# EasyEDA Pro project bandolibre.eprj, schematic ProgramConnector
Board Name: ProgramConnector; Create Date: 2026-05-26; Page Name: P1; Project Name: bandoneo; Schematic Name: ProgramConnector; Update Date: 2026-05-26; Company: EasyEDA.com; Page Size: A4; Version: V1.0
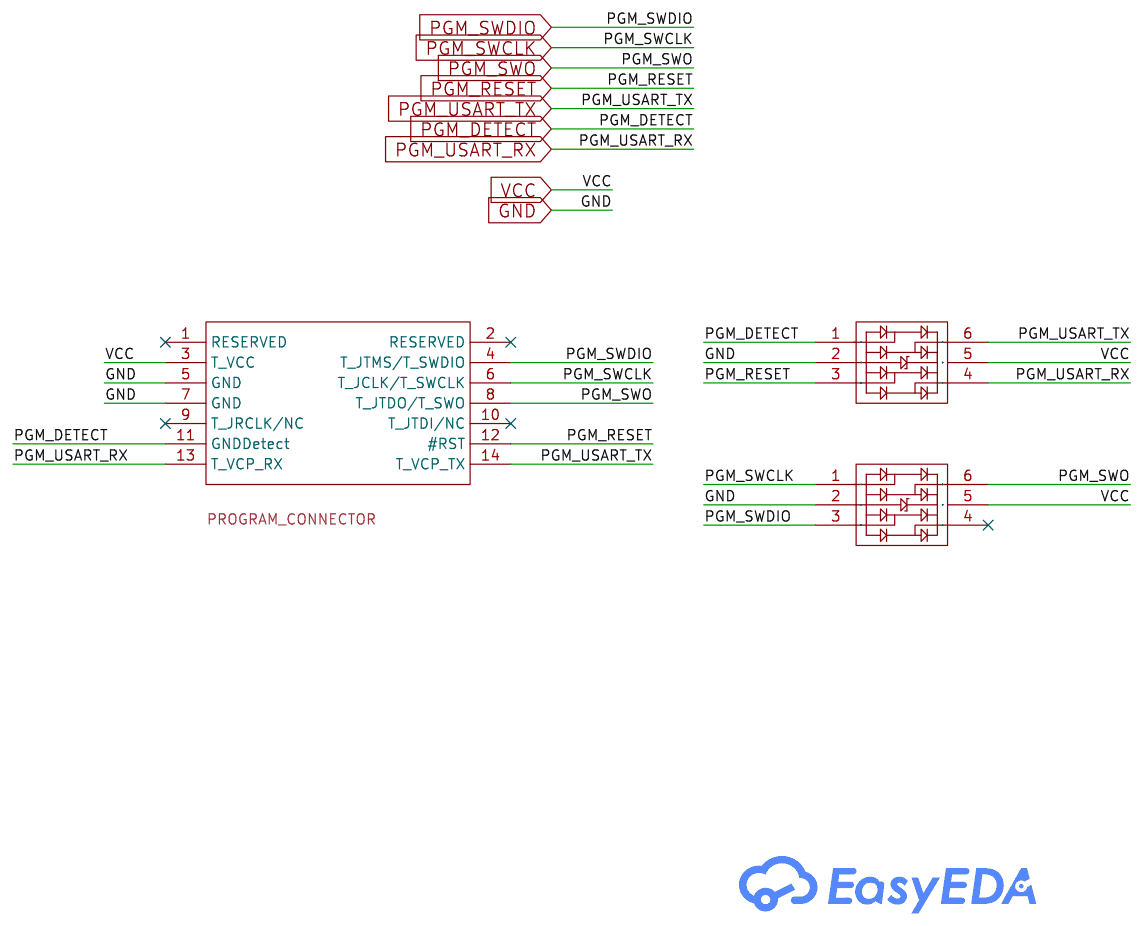
[diagram p7: schematic sheet]

## Parts
CN3  -  [TC2070_Landing_Pattern]  (no BOM)
TV5  SRV05-4-P-T7  [SOT-23-6_L2.9-W1.6-P0.95-LS2.8-BR]
TV6  SRV05-4-P-T7  [SOT-23-6_L2.9-W1.6-P0.95-LS2.8-BR]

## Library data of the parts
CN3 = STDC14_Connector: PROGRAM_CONNECTOR
TV5 TV6 = SRV05-4-P-T7_C85364: Reverse Stand-Off Voltage (Vrwm):5V Clamping Voltage:12V Peak Pulse Current (Ipp):1A@8/20us Voltage - Breakdown:6V Type:TVS; Supplier Part: C85364; Manufacturer: PROTEK; Supplier Footprint: SOT-23-6; JLCPCB Part Class: Extended Part; Datasheet: https://atta.szlcsc.com/upload/public/pdf/source/20161024/1477288764689.pdf; Supplier: LCSC; Reverse Stand-Off Voltage (Vrwm): 5V; Clamping Voltage: 12V; Peak Pulse Current (Ipp): 1A@8/20us; Voltage - Breakdown: 6V; Type: TVS

## Nets
GND: CN3.5(GND) CN3.7(GND) TV5.2 TV6.2
VCC: CN3.3(T_VCC) TV5.5 TV6.5
PGM_DETECT: CN3.11(GNDDetect) TV5.1
PGM_RESET: CN3.12(#RST) TV5.3
PGM_SWCLK: CN3.6(T_JCLK/T_SWCLK) TV6.1
PGM_SWDIO: CN3.4(T_JTMS/T_SWDIO) TV6.3
PGM_SWO: CN3.8(T_JTDO/T_SWO) TV6.6
PGM_USART_RX: CN3.13(T_VCP_RX) TV5.4
PGM_USART_TX: CN3.14(T VCP TX) TV5.6

Not connected (* = marked no-connect by the designer): CN3 1(RESERVED)* 2(RESERVED)* 9(T_JRCLK/NC)* 10(T_JTDI/NC)*; TV6 4*
